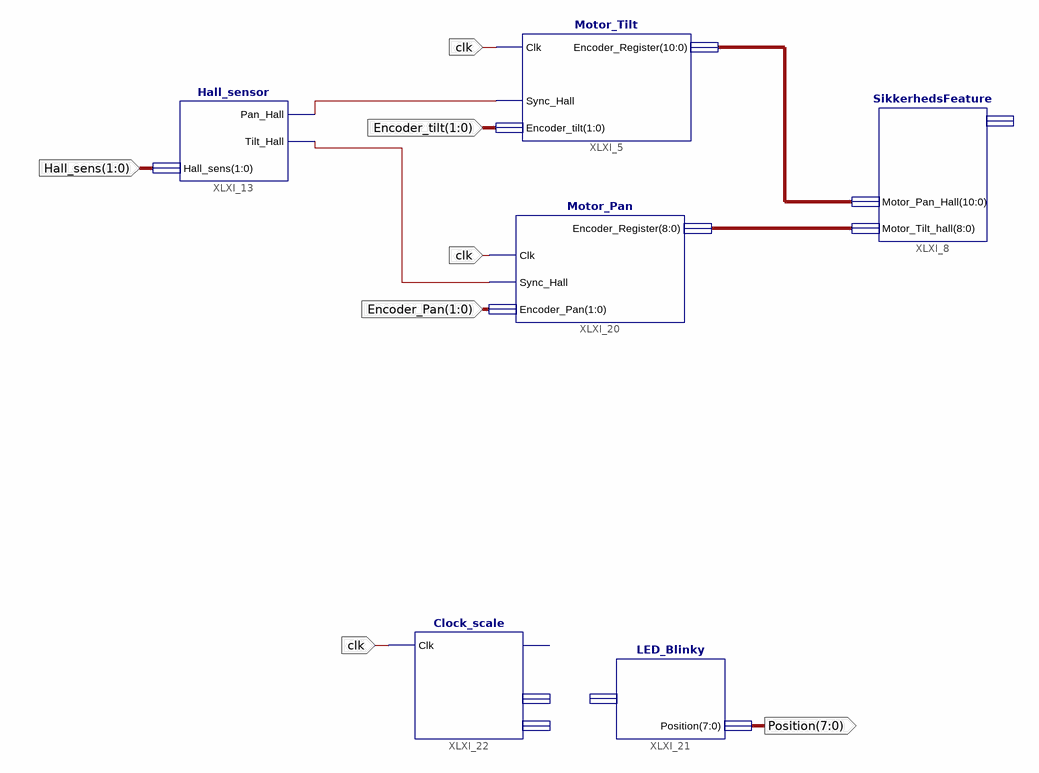
[diagram p0: schematic sheet 1]
// Xilinx ISE schematic Schematic_File.sch (spartan3e) as structural Verilog: 6 symbols, 5 ports
module Schematic_File (
  input  clk,
  input  [1:0] Hall_sens,
  input  [1:0] Encoder_Pan,
  input  [1:0] Encoder_tilt,
  output [7:0] Position
);

  wire XLXN_21, XLXN_30;
  wire [8:0] XLXN_46;
  wire [10:0] XLXN_47;

  Hall_sensor XLXI_13 (.Hall_sens(Hall_sens), .Pan_Hall(XLXN_21), .Tilt_Hall(XLXN_30));
  SikkerhedsFeature XLXI_8 (.Motor_Pan_Hall(XLXN_47), .Motor_Tilt_hall(XLXN_46));  // open: Stop
  Motor_Pan XLXI_20 (.Clk(clk), .Sync_Hall(XLXN_30), .Encoder_Pan(Encoder_Pan), .Encoder_Register(XLXN_46));
  Motor_Tilt XLXI_5 (.Clk(clk), .Sync_Hall(XLXN_21), .Encoder_tilt(Encoder_tilt), .Encoder_Register(XLXN_47));
  LED_Blinky XLXI_21 (.Position(Position));  // open: Input
  Clock_scale XLXI_22 (.Clk(clk));  // open: Clk_100hz, Fake_Encoder_pan, Fake_Encoder_Tilt
endmodule
